# Altium schematic sheet Лист 3.SchDoc
size 420 x 297 mm; Author: ALTIUM GOSTBOM2.0 KEV; SheetNumber: 3; SheetTotal: 4; Обозначение_Код: ФЮРА.442576.001 Э3
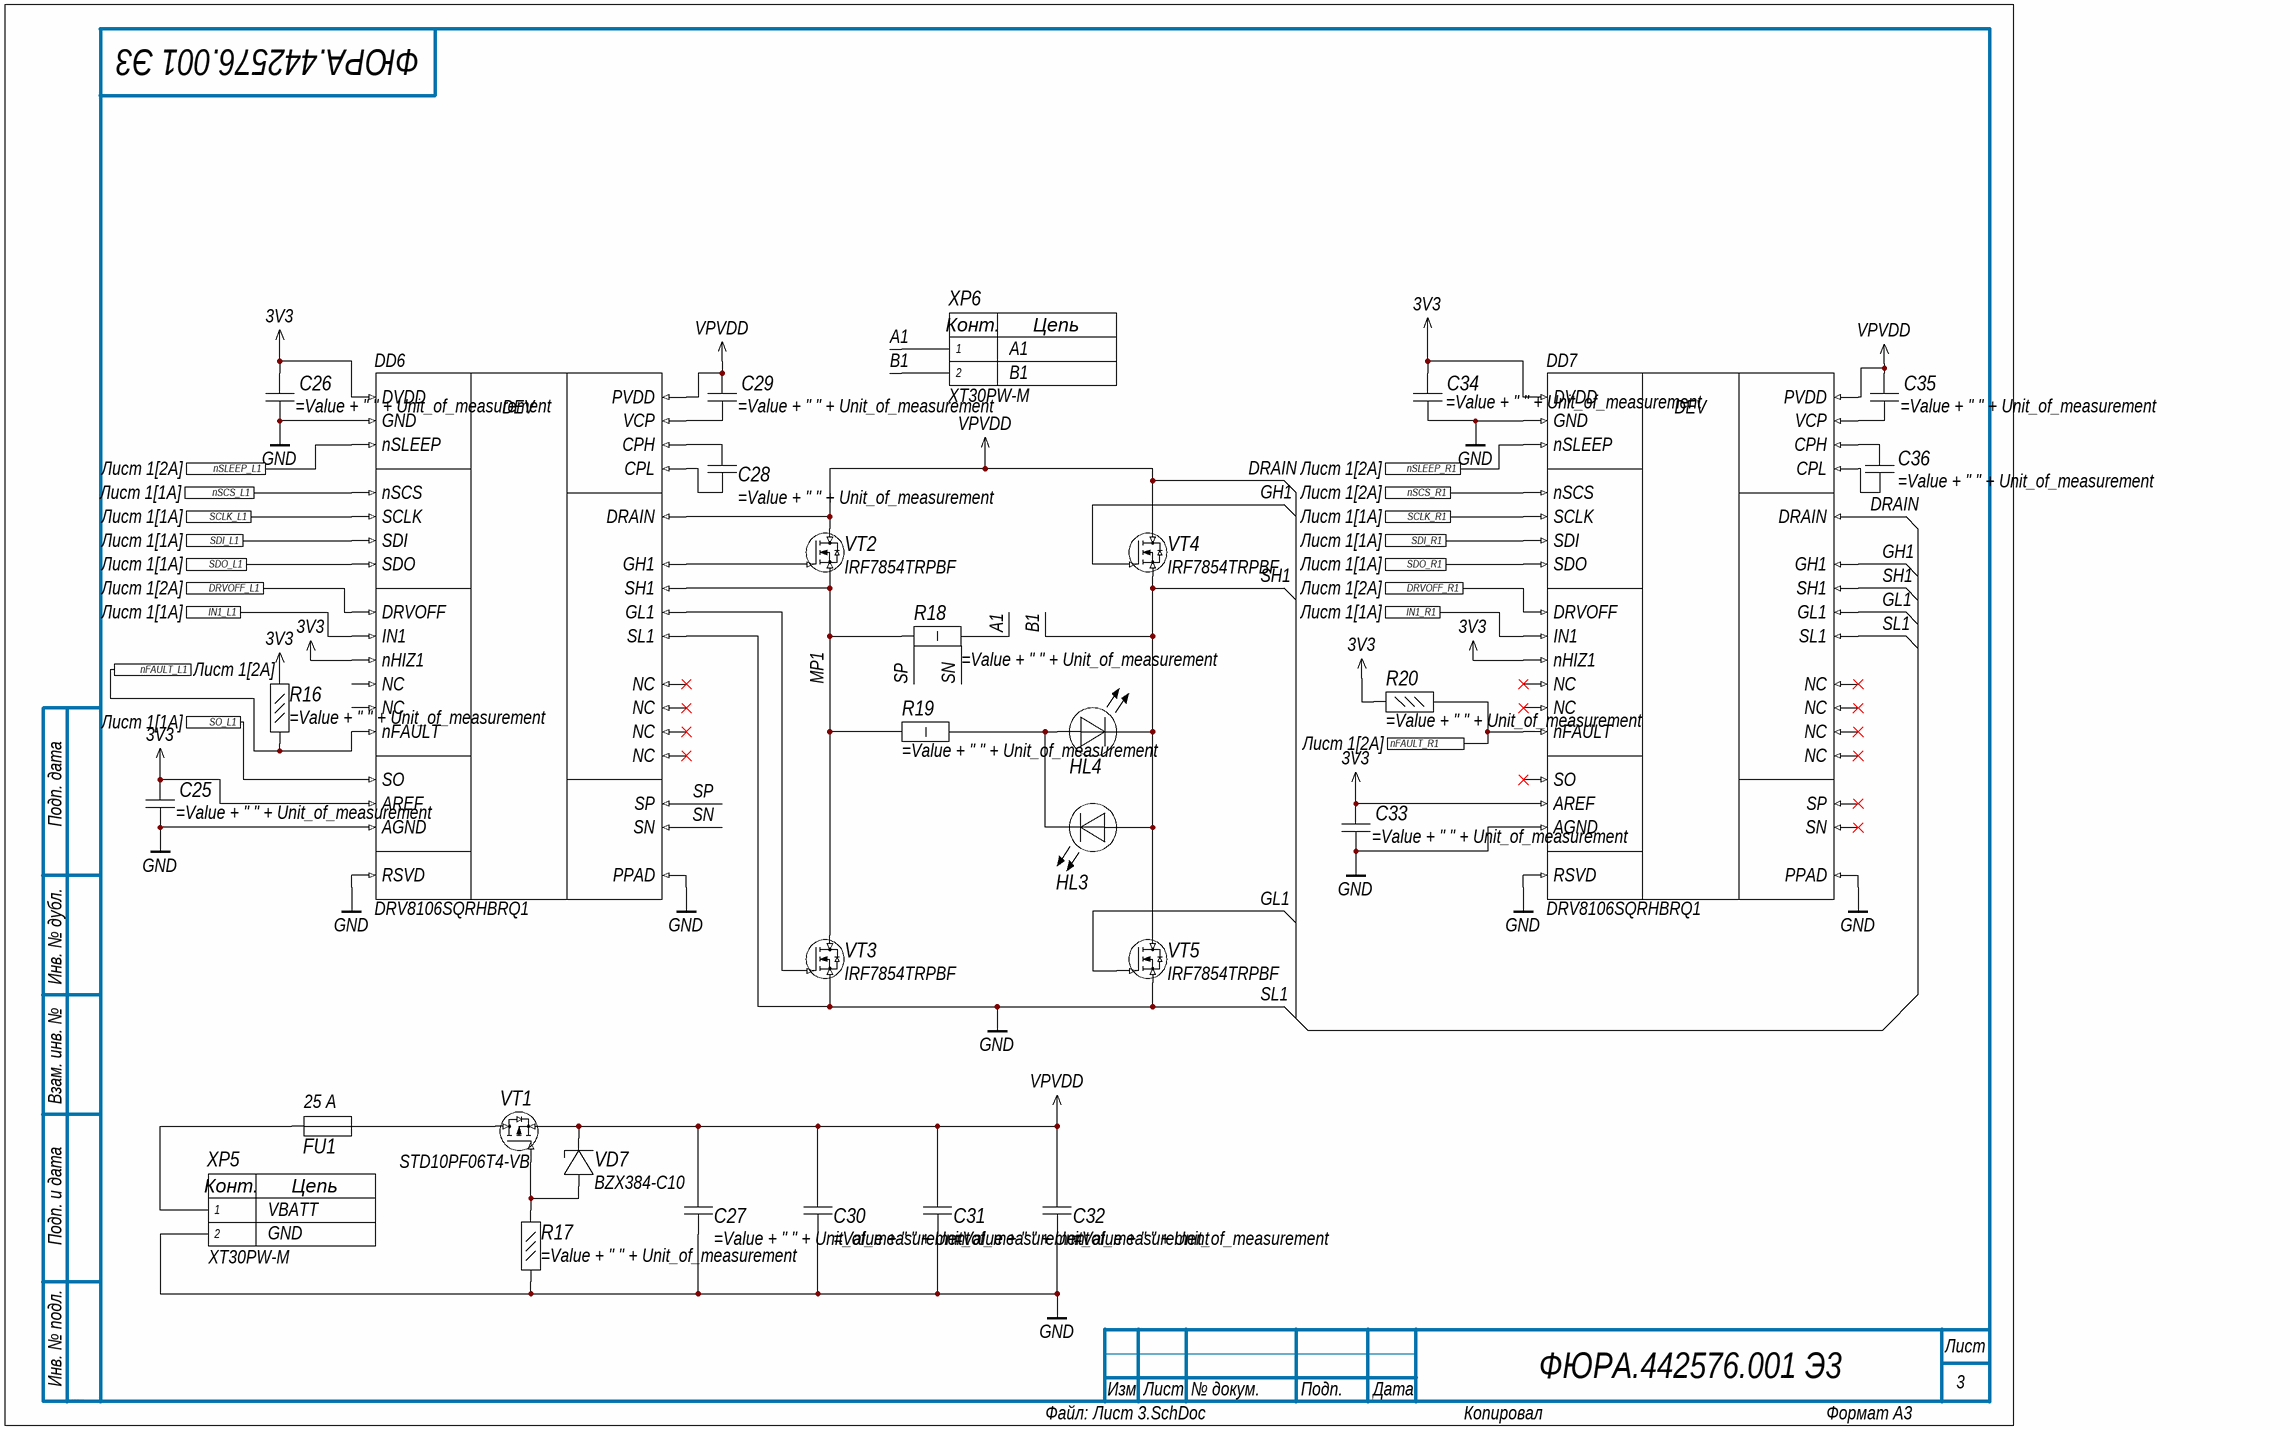
[diagram p0: Лист 3.SchDoc]

## Parts
C25  (no value)  [CAP_0603]
C26  (no value)  [CAP_0603]
C27  (no value)  [CAP_0603]
C28  (no value)  [CAP_0603]
C29  (no value)  [CAP_0603]
C30  (no value)  [CAP_1206]
C31  (no value)  [CAP_1206]
C32  (no value)  [CAP_1206]
C33  (no value)  [CAP_0603]
C34  (no value)  [CAP_0603]
C35  (no value)  [CAP_0603]
C36  (no value)  [CAP_0603]
DD6  DRV8106SQRHBRQ1  [VQFN32]
DD7  DRV8106SQRHBRQ1  [VQFN32]
FU1  ва  [Fuse 5x20]  (value not drawn)
HL3  3  [LED_0805]  (value not drawn)
HL4  3  [LED_0805]  (value not drawn)
R16  (no value)  [RES_0603]
R17  (no value)  [RES_0603]
R18  (no value)  [RES_2512]
R19  (no value)  [RES_2512]
R20  (no value)  [RES_0603]
VD7  BZX384-C10  [SOD-323]
VT1  STD10PF06T4-VB  [DPAK_TO252]
VT2  IRF7854TRPBF  [SOP-8 WithoutTP]
VT3  IRF7854TRPBF  [SOP-8 WithoutTP]
VT4  IRF7854TRPBF  [SOP-8 WithoutTP]
VT5  IRF7854TRPBF  [SOP-8 WithoutTP]
XP5  XT30PW-M  [XT30PW-M]
XP6  XT30PW-M  [XT30PW-M]

## Ports
DRVOFF_L1 (see Лист 1[2A]), DRVOFF_R1 (see Лист 1[2A]), IN1_L1 (see Лист 1[1A]), IN1_R1 (see Лист 1[1A]), nFAULT_L1 (see Лист 1[2A]), nFAULT_R1 (see Лист 1[2A]), nSCS_L1 (see Лист 1[1A]), nSCS_R1 (see Лист 1[2A]), nSLEEP_L1 (see Лист 1[2A]), nSLEEP_R1 (see Лист 1[2A]), SCLK_L1 (see Лист 1[1A]), SCLK_R1 (see Лист 1[1A]), SDI_L1 (see Лист 1[1A]), SDI_R1 (see Лист 1[1A]), SDO_L1 (see Лист 1[1A]), SDO_R1 (see Лист 1[1A]), SO_L1 (see Лист 1[1A])

## Nets
3V3: C25.2 C26.2 C33.2 C34.2 DD6.2(DVDD) DD6.8(nHIZ1) DD6.16(AREF) DD7.2(DVDD) DD7.8(nHIZ1) DD7.16(AREF) R16.2 R20.2
DRAIN: C27.2 C29.2 C30.2 C31.2 C32.2 C35.2 DD6.28(DRAIN) DD6.29(PVDD) DD7.28(DRAIN) DD7.29(PVDD) VD7.1 VT1.3(S) VT2.3 VT4.3  [also labelled VPVDD]
SL1: C25.1 C26.1 C27.1 C30.1 C31.1 C32.1 C33.1 C34.1 DD6.0(PPAD) DD6.1(GND) DD6.15(RSVD) DD6.17(AGND) DD6.23(SL1) DD7.0(PPAD) DD7.1(GND) DD7.15(RSVD) DD7.17(AGND) DD7.23(SL1) R17.1 VT3.2 VT5.2 XP5.2  [also labelled GND]
A1: R18.1 XP6.1
B1: DD7.21(SH1) HL3.A HL4.C VT4.2 VT5.3 XP6.2  [also labelled SH1]
DRVOFF_L1: DD6.12(DRVOFF) ; port DRVOFF_L1
DRVOFF_R1: DD7.12(DRVOFF) ; port DRVOFF_R1
GH1: DD7.20(GH1) VT4.1
GL1: DD7.22(GL1) VT5.1
IN1_L1: DD6.7(IN1) ; port IN1_L1
IN1_R1: DD7.7(IN1) ; port IN1_R1
MP1: DD6.21(SH1) R18.2 R19.1 VT2.2 VT3.3
nFAULT_L1: DD6.13(nFAULT) R16.1 ; port nFAULT_L1
nFAULT_R1: DD7.13(nFAULT) R20.1 ; port nFAULT_R1
nSCS_L1: DD6.3(nSCS) ; port nSCS_L1
nSCS_R1: DD7.3(nSCS) ; port nSCS_R1
nSLEEP_L1: DD6.11(nSLEEP) ; port nSLEEP_L1
nSLEEP_R1: DD7.11(nSLEEP) ; port nSLEEP_R1
SCLK_L1: DD6.4(SCLK) ; port SCLK_L1
SCLK_R1: DD7.4(SCLK) ; port SCLK_R1
SDI_L1: DD6.5(SDI) ; port SDI_L1
SDI_R1: DD7.5(SDI) ; port SDI_R1
SDO_L1: DD6.6(SDO) ; port SDO_L1
SDO_R1: DD7.6(SDO) ; port SDO_R1
SN: DD6.19(SN) R18.1
SO_L1: DD6.14(SO) ; port SO_L1
SP: DD6.18(SP) R18.2
NetC28_1: C28.1 DD6.32(CPL)
NetC28_2: C28.2 DD6.31(CPH)
NetC29_1: C29.1 DD6.30(VCP)
NetC35_1: C35.1 DD7.30(VCP)
NetC36_1: C36.1 DD7.32(CPL)
NetC36_2: C36.2 DD7.31(CPH)
NetDD6_20: DD6.20(GH1) VT2.1
NetDD6_22: DD6.22(GL1) VT3.1
NetFU1_1: FU1.1 XP5.1
NetFU1_2: FU1.2 VT1.4(D)
NetHL3_C: HL3.C HL4.A R19.2
NetR17_2: R17.2 VD7.2 VT1.1(G)

Not connected (* = marked no-connect by the designer): DD6 9(NC) 10(NC) 24(NC)* 25(NC)* 26(NC)* 27(NC)*; DD7 9(NC)* 10(NC)* 14(SO)* 18(SP)* 19(SN)* 24(NC)* 25(NC)* 26(NC)* 27(NC)*

## Notes on the sheet
- A1
- B1
- (near FU1) 25 А
- VBATT
- GND
- Подп. дата
- Инв. № дубл.
- Взам. инв. №
- Подп. и дата
- Инв. № подл.
- Изм.
- Лист
- № докум.
- Подп.
- Дата
- ALTIUM GOSTBOM2.0 KEV
- Файл:
- Копировал
- Формат А3
- (in symbol DRV8106SQRHBRQ1) DEV
- (in symbol XT30PW-M) Конт.; Цепь

## Library data of the parts
C25 C26 C33 C34 = CAP_0603: Конденсатор керамический, типоразмера 0603; Value: 1; Unit_of_measurement: мкФ 6.3В; ComponentLink1Description: New link; ComponentLink1URL: *
C27 C28 C36 = CAP_0603: Конденсатор керамический, типоразмера 0603; Value: 0,1; Unit_of_measurement: мкФ 50 В; ComponentLink1Description: New link; ComponentLink1URL: *
C29 C35 = CAP_0603: Конденсатор керамический, типоразмера 0603; Value: 1; Unit_of_measurement: мкФ 16 В; ComponentLink1Description: New link; ComponentLink1URL: *
C30-C32 = CAP_1206: Конденсатор керамический, типоразмера 1206; Value: 10; Unit_of_measurement: мкФ 50В; ComponentLink1Description: New link; ComponentLink1URL: *
DD6 DD7 = DRV8106SQRHBRQ1: Automotive, 40-V, half-bridge Smart Gate Driver w/offline diagnostics and inline current sense amp.
FU1 = Fuse: Предохранитель плавкий 5x20
HL3 HL4 = LED_0805: Светодиод SMD 0805=2x1.3мм, красный, 28мкд, 130град, прозрачная линза; Q-15575B СД SMD02013C2\кр\ 28,5\130\пр\FYLS- 0805HD\FORYARD; Unit_of_measurement: Ом; Value: *; ComponentLink1Description: New link; ComponentLink1URL: *
R16 R17 R20 = RES_0603: Резистор, типоразмера 0603; Value: 10; Unit_of_measurement: кОм; ComponentLink1Description: New link; ComponentLink1URL: *
R18 = ResShunt_2512: Резистор, типоразмера 2512; Value: 7.5; Unit_of_measurement: мОм; ComponentLink1Description: New link; ComponentLink1URL: *
R19 = RES_2512: Резистор, типоразмера 2512; Value: 1.8; Unit_of_measurement: кОм; ComponentLink1Description: New link; ComponentLink1URL: *
VD7 = BZX384-C18: Стабилитрон 10В 0.3Вт [SOD-323]; Unit_of_measurement: Ом; Value: *; ComponentLink1Description: New link; ComponentLink1URL: *
VT1 = STD10PF06T4-VB: Транзистор P-MOSFET 60В 30А 34Вт [D-PAK]
VT2-VT5 = IRF7854TRPBF: Транзистор, HEXFET, N-канал, 80В, 10А [SOIC-8]; pin to pad: 1>4 2>1+2+3 3>5+6+7+8
XP5 XP6 = XT30PW-M: Socket; DC supply; XT30; male; PIN: 2; on PCBs; THT; yellow; 15A; 500V